# Altium schematic sheet MatrixLantern.SchDoc
size A4
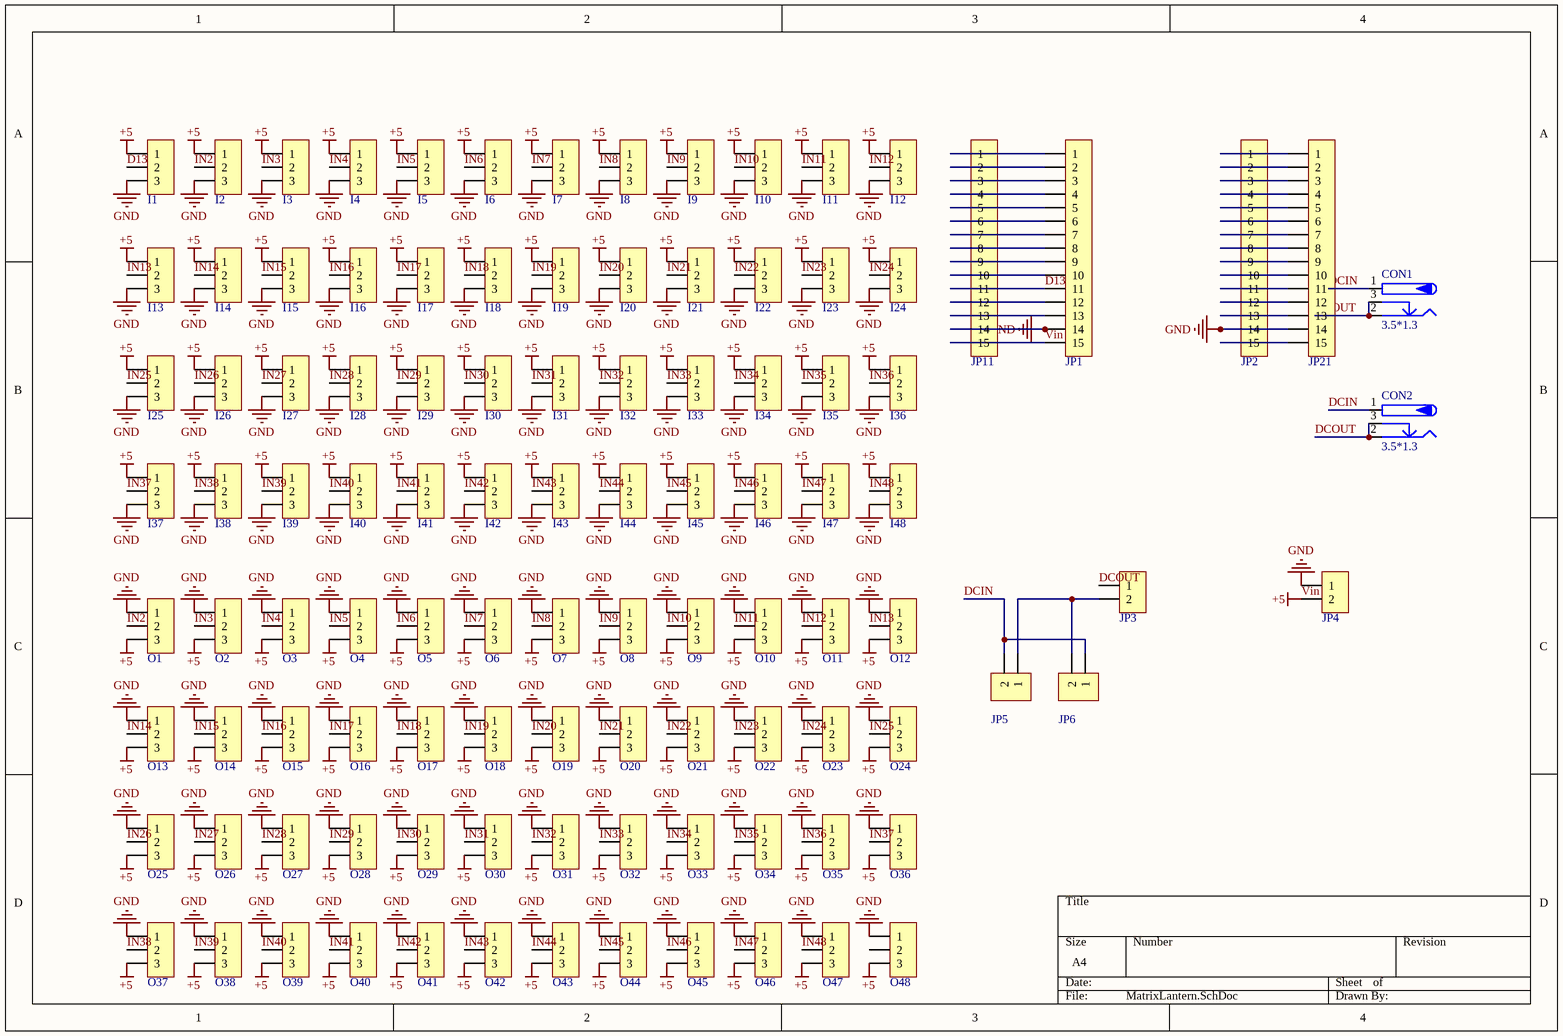
[diagram p0: MatrixLantern.SchDoc]

## Parts
CON1  3.5*1.3  [DC-012]
CON2  3.5*1.3  [DC-012]
I1  HDR-1X3  [ZH1.5-WS-3P]  (value not drawn)
I2  HDR-1X3  [ZH1.5-WS-3P]  (value not drawn)
I3  HDR-1X3  [ZH1.5-WS-3P]  (value not drawn)
I4  HDR-1X3  [ZH1.5-WS-3P]  (value not drawn)
I5  HDR-1X3  [ZH1.5-WS-3P]  (value not drawn)
I6  HDR-1X3  [ZH1.5-WS-3P]  (value not drawn)
I7  HDR-1X3  [ZH1.5-WS-3P]  (value not drawn)
I8  HDR-1X3  [ZH1.5-WS-3P]  (value not drawn)
I9  HDR-1X3  [ZH1.5-WS-3P]  (value not drawn)
I10  HDR-1X3  [ZH1.5-WS-3P]  (value not drawn)
I11  HDR-1X3  [ZH1.5-WS-3P]  (value not drawn)
I12  HDR-1X3  [ZH1.5-WS-3P]  (value not drawn)
I13  HDR-1X3  [ZH1.5-WS-3P]  (value not drawn)
I14  HDR-1X3  [ZH1.5-WS-3P]  (value not drawn)
I15  HDR-1X3  [ZH1.5-WS-3P]  (value not drawn)
I16  HDR-1X3  [ZH1.5-WS-3P]  (value not drawn)
I17  HDR-1X3  [ZH1.5-WS-3P]  (value not drawn)
I18  HDR-1X3  [ZH1.5-WS-3P]  (value not drawn)
I19  HDR-1X3  [ZH1.5-WS-3P]  (value not drawn)
I20  HDR-1X3  [ZH1.5-WS-3P]  (value not drawn)
I21  HDR-1X3  [ZH1.5-WS-3P]  (value not drawn)
I22  HDR-1X3  [ZH1.5-WS-3P]  (value not drawn)
I23  HDR-1X3  [ZH1.5-WS-3P]  (value not drawn)
I24  HDR-1X3  [ZH1.5-WS-3P]  (value not drawn)
I25  HDR-1X3  [ZH1.5-WS-3P]  (value not drawn)
I26  HDR-1X3  [ZH1.5-WS-3P]  (value not drawn)
I27  HDR-1X3  [ZH1.5-WS-3P]  (value not drawn)
I28  HDR-1X3  [ZH1.5-WS-3P]  (value not drawn)
I29  HDR-1X3  [ZH1.5-WS-3P]  (value not drawn)
I30  HDR-1X3  [ZH1.5-WS-3P]  (value not drawn)
I31  HDR-1X3  [ZH1.5-WS-3P]  (value not drawn)
I32  HDR-1X3  [ZH1.5-WS-3P]  (value not drawn)
I33  HDR-1X3  [ZH1.5-WS-3P]  (value not drawn)
I34  HDR-1X3  [ZH1.5-WS-3P]  (value not drawn)
I35  HDR-1X3  [ZH1.5-WS-3P]  (value not drawn)
I36  HDR-1X3  [ZH1.5-WS-3P]  (value not drawn)
I37  HDR-1X3  [ZH1.5-WS-3P]  (value not drawn)
I38  HDR-1X3  [ZH1.5-WS-3P]  (value not drawn)
I39  HDR-1X3  [ZH1.5-WS-3P]  (value not drawn)
I40  HDR-1X3  [ZH1.5-WS-3P]  (value not drawn)
I41  HDR-1X3  [ZH1.5-WS-3P]  (value not drawn)
I42  HDR-1X3  [ZH1.5-WS-3P]  (value not drawn)
I43  HDR-1X3  [ZH1.5-WS-3P]  (value not drawn)
I44  HDR-1X3  [ZH1.5-WS-3P]  (value not drawn)
I45  HDR-1X3  [ZH1.5-WS-3P]  (value not drawn)
I46  HDR-1X3  [ZH1.5-WS-3P]  (value not drawn)
I47  HDR-1X3  [ZH1.5-WS-3P]  (value not drawn)
I48  HDR-1X3  [ZH1.5-WS-3P]  (value not drawn)
JP1  HDR-1X15  [HDR2.54-M-LI-15P]  (value not drawn)
JP2  HDR-1X15  [HDR2.54-M-LI-15P]  (value not drawn)
JP3  HDR-1X2  [KF350-2P]  (value not drawn)
JP4  HDR-1X2  [KF350-2P]  (value not drawn)
JP5  HDR-1X2  [KF350-2P]  (value not drawn)
JP6  HDR-1X2  [KF350-2P]  (value not drawn)
JP11  HDR-1X15  [HDR2.54-LI-15P]  (value not drawn)
JP21  HDR-1X15  [HDR2.54-LI-15P]  (value not drawn)
O1  HDR-1X3  [ZH1.5-WS-3P]  (value not drawn)
O2  HDR-1X3  [ZH1.5-WS-3P]  (value not drawn)
O3  HDR-1X3  [ZH1.5-WS-3P]  (value not drawn)
O4  HDR-1X3  [ZH1.5-WS-3P]  (value not drawn)
O5  HDR-1X3  [ZH1.5-WS-3P]  (value not drawn)
O6  HDR-1X3  [ZH1.5-WS-3P]  (value not drawn)
O7  HDR-1X3  [ZH1.5-WS-3P]  (value not drawn)
O8  HDR-1X3  [ZH1.5-WS-3P]  (value not drawn)
O9  HDR-1X3  [ZH1.5-WS-3P]  (value not drawn)
O10  HDR-1X3  [ZH1.5-WS-3P]  (value not drawn)
O11  HDR-1X3  [ZH1.5-WS-3P]  (value not drawn)
O12  HDR-1X3  [ZH1.5-WS-3P]  (value not drawn)
O13  HDR-1X3  [ZH1.5-WS-3P]  (value not drawn)
O14  HDR-1X3  [ZH1.5-WS-3P]  (value not drawn)
O15  HDR-1X3  [ZH1.5-WS-3P]  (value not drawn)
O16  HDR-1X3  [ZH1.5-WS-3P]  (value not drawn)
O17  HDR-1X3  [ZH1.5-WS-3P]  (value not drawn)
O18  HDR-1X3  [ZH1.5-WS-3P]  (value not drawn)
O19  HDR-1X3  [ZH1.5-WS-3P]  (value not drawn)
O20  HDR-1X3  [ZH1.5-WS-3P]  (value not drawn)
O21  HDR-1X3  [ZH1.5-WS-3P]  (value not drawn)
O22  HDR-1X3  [ZH1.5-WS-3P]  (value not drawn)
O23  HDR-1X3  [ZH1.5-WS-3P]  (value not drawn)
O24  HDR-1X3  [ZH1.5-WS-3P]  (value not drawn)
O25  HDR-1X3  [ZH1.5-WS-3P]  (value not drawn)
O26  HDR-1X3  [ZH1.5-WS-3P]  (value not drawn)
O27  HDR-1X3  [ZH1.5-WS-3P]  (value not drawn)
O28  HDR-1X3  [ZH1.5-WS-3P]  (value not drawn)
O29  HDR-1X3  [ZH1.5-WS-3P]  (value not drawn)
O30  HDR-1X3  [ZH1.5-WS-3P]  (value not drawn)
O31  HDR-1X3  [ZH1.5-WS-3P]  (value not drawn)
O32  HDR-1X3  [ZH1.5-WS-3P]  (value not drawn)
O33  HDR-1X3  [ZH1.5-WS-3P]  (value not drawn)
O34  HDR-1X3  [ZH1.5-WS-3P]  (value not drawn)
O35  HDR-1X3  [ZH1.5-WS-3P]  (value not drawn)
O36  HDR-1X3  [ZH1.5-WS-3P]  (value not drawn)
O37  HDR-1X3  [ZH1.5-WS-3P]  (value not drawn)
O38  HDR-1X3  [ZH1.5-WS-3P]  (value not drawn)
O39  HDR-1X3  [ZH1.5-WS-3P]  (value not drawn)
O40  HDR-1X3  [ZH1.5-WS-3P]  (value not drawn)
O41  HDR-1X3  [ZH1.5-WS-3P]  (value not drawn)
O42  HDR-1X3  [ZH1.5-WS-3P]  (value not drawn)
O43  HDR-1X3  [ZH1.5-WS-3P]  (value not drawn)
O44  HDR-1X3  [ZH1.5-WS-3P]  (value not drawn)
O45  HDR-1X3  [ZH1.5-WS-3P]  (value not drawn)
O46  HDR-1X3  [ZH1.5-WS-3P]  (value not drawn)
O47  HDR-1X3  [ZH1.5-WS-3P]  (value not drawn)
O48  HDR-1X3  [ZH1.5-WS-3P]  (value not drawn)

## Nets
GND: I1.3 I2.3 I3.3 I4.3 I5.3 I6.3 I7.3 I8.3 I9.3 I10.3 I11.3 I12.3 I13.3 I14.3 I15.3 I16.3 I17.3 I18.3 I19.3 I20.3 I21.3 I22.3 I23.3 I24.3 I25.3 I26.3 I27.3 I28.3 I29.3 I30.3 I31.3 I32.3 I33.3 I34.3 I35.3 I36.3 I37.3 I38.3 I39.3 I40.3 I41.3 I42.3 I43.3 I44.3 I45.3 I46.3 I47.3 I48.3 JP1.14 JP2.14 JP4.1 JP11.14 JP21.14 O1.1 O2.1 O3.1 O4.1 O5.1 O6.1 O7.1 O8.1 O9.1 O10.1 O11.1 O12.1 O13.1 O14.1 O15.1 O16.1 O17.1 O18.1 O19.1 O20.1 O21.1 O22.1 O23.1 O24.1 O25.1 O26.1 O27.1 O28.1 O29.1 O30.1 O31.1 O32.1 O33.1 O34.1 O35.1 O36.1 O37.1 O38.1 O39.1 O40.1 O41.1 O42.1 O43.1 O44.1 O45.1 O46.1 O47.1 O48.1
Vin: I1.1 I2.1 I3.1 I4.1 I5.1 I6.1 I7.1 I8.1 I9.1 I10.1 I11.1 I12.1 I13.1 I14.1 I15.1 I16.1 I17.1 I18.1 I19.1 I20.1 I21.1 I22.1 I23.1 I24.1 I25.1 I26.1 I27.1 I28.1 I29.1 I30.1 I31.1 I32.1 I33.1 I34.1 I35.1 I36.1 I37.1 I38.1 I39.1 I40.1 I41.1 I42.1 I43.1 I44.1 I45.1 I46.1 I47.1 I48.1 JP1.15 JP4.2 JP11.15 O1.3 O2.3 O3.3 O4.3 O5.3 O6.3 O7.3 O8.3 O9.3 O10.3 O11.3 O12.3 O13.3 O14.3 O15.3 O16.3 O17.3 O18.3 O19.3 O20.3 O21.3 O22.3 O23.3 O24.3 O25.3 O26.3 O27.3 O28.3 O29.3 O30.3 O31.3 O32.3 O33.3 O34.3 O35.3 O36.3 O37.3 O38.3 O39.3 O40.3 O41.3 O42.3 O43.3 O44.3 O45.3 O46.3 O47.3 O48.3  [also labelled +5]
D13: I1.2 JP1.11 JP11.11
DCIN: CON1.1 CON2.1 JP5.2 JP6.1
DCOUT: CON1.2 CON1.3 CON2.2 CON2.3 JP3.1
IN2: I2.2 O1.2
IN3: I3.2 O2.2
IN4: I4.2 O3.2
IN5: I5.2 O4.2
IN6: I6.2 O5.2
IN7: I7.2 O6.2
IN8: I8.2 O7.2
IN9: I9.2 O8.2
IN10: I10.2 O9.2
IN11: I11.2 O10.2
IN12: I12.2 O11.2
IN13: I13.2 O12.2
IN14: I14.2 O13.2
IN15: I15.2 O14.2
IN16: I16.2 O15.2
IN17: I17.2 O16.2
IN18: I18.2 O17.2
IN19: I19.2 O18.2
IN20: I20.2 O19.2
IN21: I21.2 O20.2
IN22: I22.2 O21.2
IN23: I23.2 O22.2
IN24: I24.2 O23.2
IN25: I25.2 O24.2
IN26: I26.2 O25.2
IN27: I27.2 O26.2
IN28: I28.2 O27.2
IN29: I29.2 O28.2
IN30: I30.2 O29.2
IN31: I31.2 O30.2
IN32: I32.2 O31.2
IN33: I33.2 O32.2
IN34: I34.2 O33.2
IN35: I35.2 O34.2
IN36: I36.2 O35.2
IN37: I37.2 O36.2
IN38: I38.2 O37.2
IN39: I39.2 O38.2
IN40: I40.2 O39.2
IN41: I41.2 O40.2
IN42: I42.2 O41.2
IN43: I43.2 O42.2
IN44: I44.2 O43.2
IN45: I45.2 O44.2
IN46: I46.2 O45.2
IN47: I47.2 O46.2
IN48: I48.2 O47.2
NetJP1_1: JP1.1 JP11.1
NetJP1_2: JP1.2 JP11.2
NetJP1_3: JP1.3 JP11.3
NetJP1_4: JP1.4 JP11.4
NetJP1_5: JP1.5 JP11.5
NetJP1_6: JP1.6 JP11.6
NetJP1_7: JP1.7 JP11.7
NetJP1_8: JP1.8 JP11.8
NetJP1_9: JP1.9 JP11.9
NetJP1_10: JP1.10 JP11.10
NetJP1_12: JP1.12 JP11.12
NetJP1_13: JP1.13 JP11.13
NetJP2_1: JP2.1 JP21.1
NetJP2_2: JP2.2 JP21.2
NetJP2_3: JP2.3 JP21.3
NetJP2_4: JP2.4 JP21.4
NetJP2_5: JP2.5 JP21.5
NetJP2_6: JP2.6 JP21.6
NetJP2_7: JP2.7 JP21.7
NetJP2_8: JP2.8 JP21.8
NetJP2_9: JP2.9 JP21.9
NetJP2_10: JP2.10 JP21.10
NetJP2_11: JP2.11 JP21.11
NetJP2_12: JP2.12 JP21.12
NetJP2_13: JP2.13 JP21.13
NetJP2_15: JP2.15 JP21.15
NetJP3_2: JP3.2 JP5.1 JP6.2

Not connected (* = marked no-connect by the designer): O48 2

## Library data of the parts
CON1 CON2 = P-DC: 低压电源接口; BOM名称: DC电源接口; 版权归属: 源创客; 学习资源: www.ooocke.com
I1-I48 O1-O48 = Header 3: 3P接插件; 版权归属: 源创客; BOM名称: 3P接插件; 学习资源: www.ooocke.com
JP1 JP2 JP11 JP21 = Header 15: 15P接插件; 版权归属: 源创客; BOM名称: 15P接插件; 学习资源: www.ooocke.com
JP3-JP6 = Header 2: 2P接插件; 版权归属: 源创客; BOM名称: 2P接插件; 学习资源: www.ooocke.com